# Altium schematic sheet Ethernet.SchDoc
size A
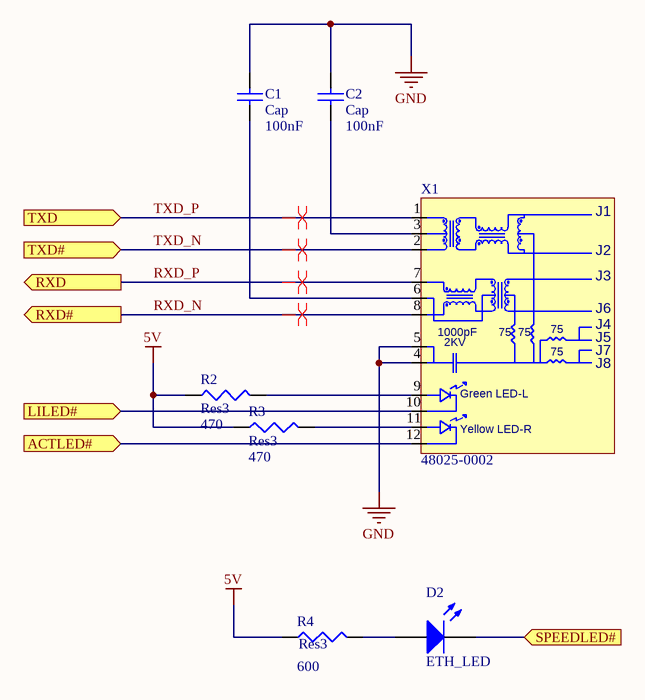
[diagram p0: Ethernet.SchDoc]

## Parts
C1  Cap  value 100nF  [0603]
C2  Cap  value 100nF  [0603]
D2  ETH_LED  [0805]
R2  Res3  value 470  [J1-0603]
R3  Res3  value 470  [J1-0603]
R4  Res3  value 600  [J1-0603]
X1  48025-0002  [48025-0002]

## Ports
ACTLED# (in), LILED# (in), RXD (out), RXD# (out), SPEEDLED# (in), TXD (in), TXD# (in)

## Nets
5V: R2.1 R3.1 R4.1
GND: C1.2 C2.2 X1.4 X1.5
ACTLED#: X1.12 ; port ACTLED#
LILED#: X1.10 ; port LILED#
RXD_N: X1.8 ; port RXD#
RXD_P: X1.7 ; port RXD
SPEEDLED#: D2.2(K) ; port SPEEDLED#
TXD_N: X1.2 ; port TXD#
TXD_P: X1.1 ; port TXD
NetC1_1: C1.1 X1.6
NetC2_1: C2.1 X1.3
NetD2_1: D2.1(A) R4.2
NetR2_2: R2.2 X1.9
NetR3_2: R3.2 X1.11

## Layout directives
differential pair: RXD_N, RXD_P, TXD_N, TXD_P

## Notes on the sheet
- (in symbol 48025-0002) J1; J2; J3; J6; J4; 1000pF; 75; 2KV; J5; J7; J8; Green LED-L; Yellow LED-R

## Library data of the parts
C1 C2 = Cap: Capacitor; Published: 8-Jun-2000; LatestRevisionDate: 17-Jul-2002; LatestRevisionNote: Re-released for DXP Platform.; PackageReference: RAD-0.3; Publisher: Altium Limited; Supplier Part #: 587-1245-1-ND; Supplier: DigiKey
D2 = LED1: Typical RED GaAs LED; Published: 8-Jun-2000; LatestRevisionDate: 08-Jul-2005; LatestRevisionNote: Mech Layer 1 removed.; PackageReference: LED-1; Publisher: Altium Limited; Supplier Part #: 475-2483-6-ND; Supplier: DigiKey
R2-R4 = Res3: Resistor; Published: 8-Jun-2000; LatestRevisionDate: 04-Mar-2005; LatestRevisionNote: PCB Footprint replaced.; PackageReference: J1-0603; Publisher: Altium Limited; Supplier: DigiKey
  R2 R3: Supplier Part #: P470HTR-ND
  R4: Supplier Part #: P604HCT-ND
X1 = 48025-0002: Modular RJ45 Jack w/ Magnetics & LEDs; Model: 48025-0002; Supplier Part #: WM5449-ND; Supplier: DigiKey